# Altium schematic sheet 04 SOC_PORT3~5.SchDoc
size 513 x 386 mm
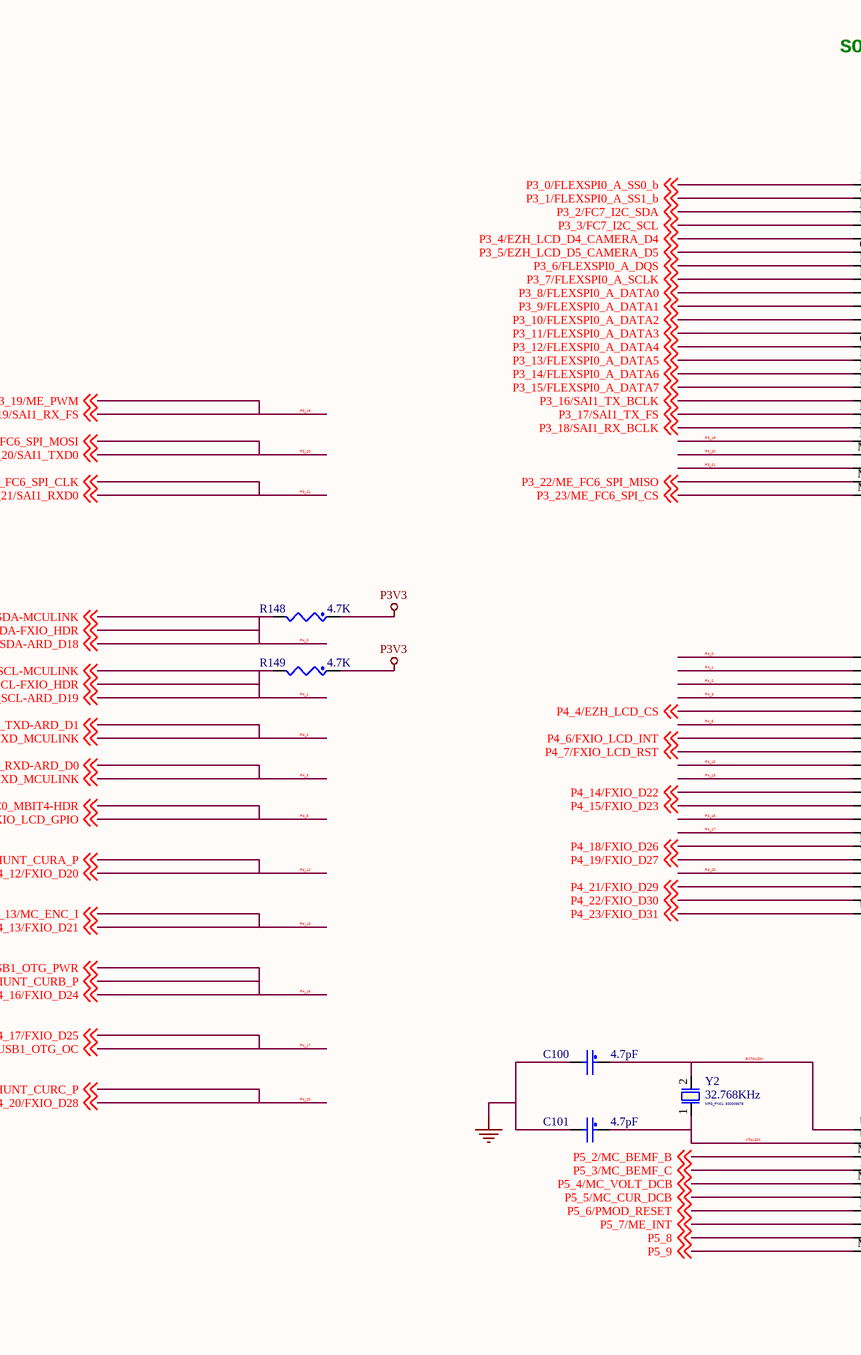
[diagram p0: 04 SOC_PORT3~5.SchDoc, left]
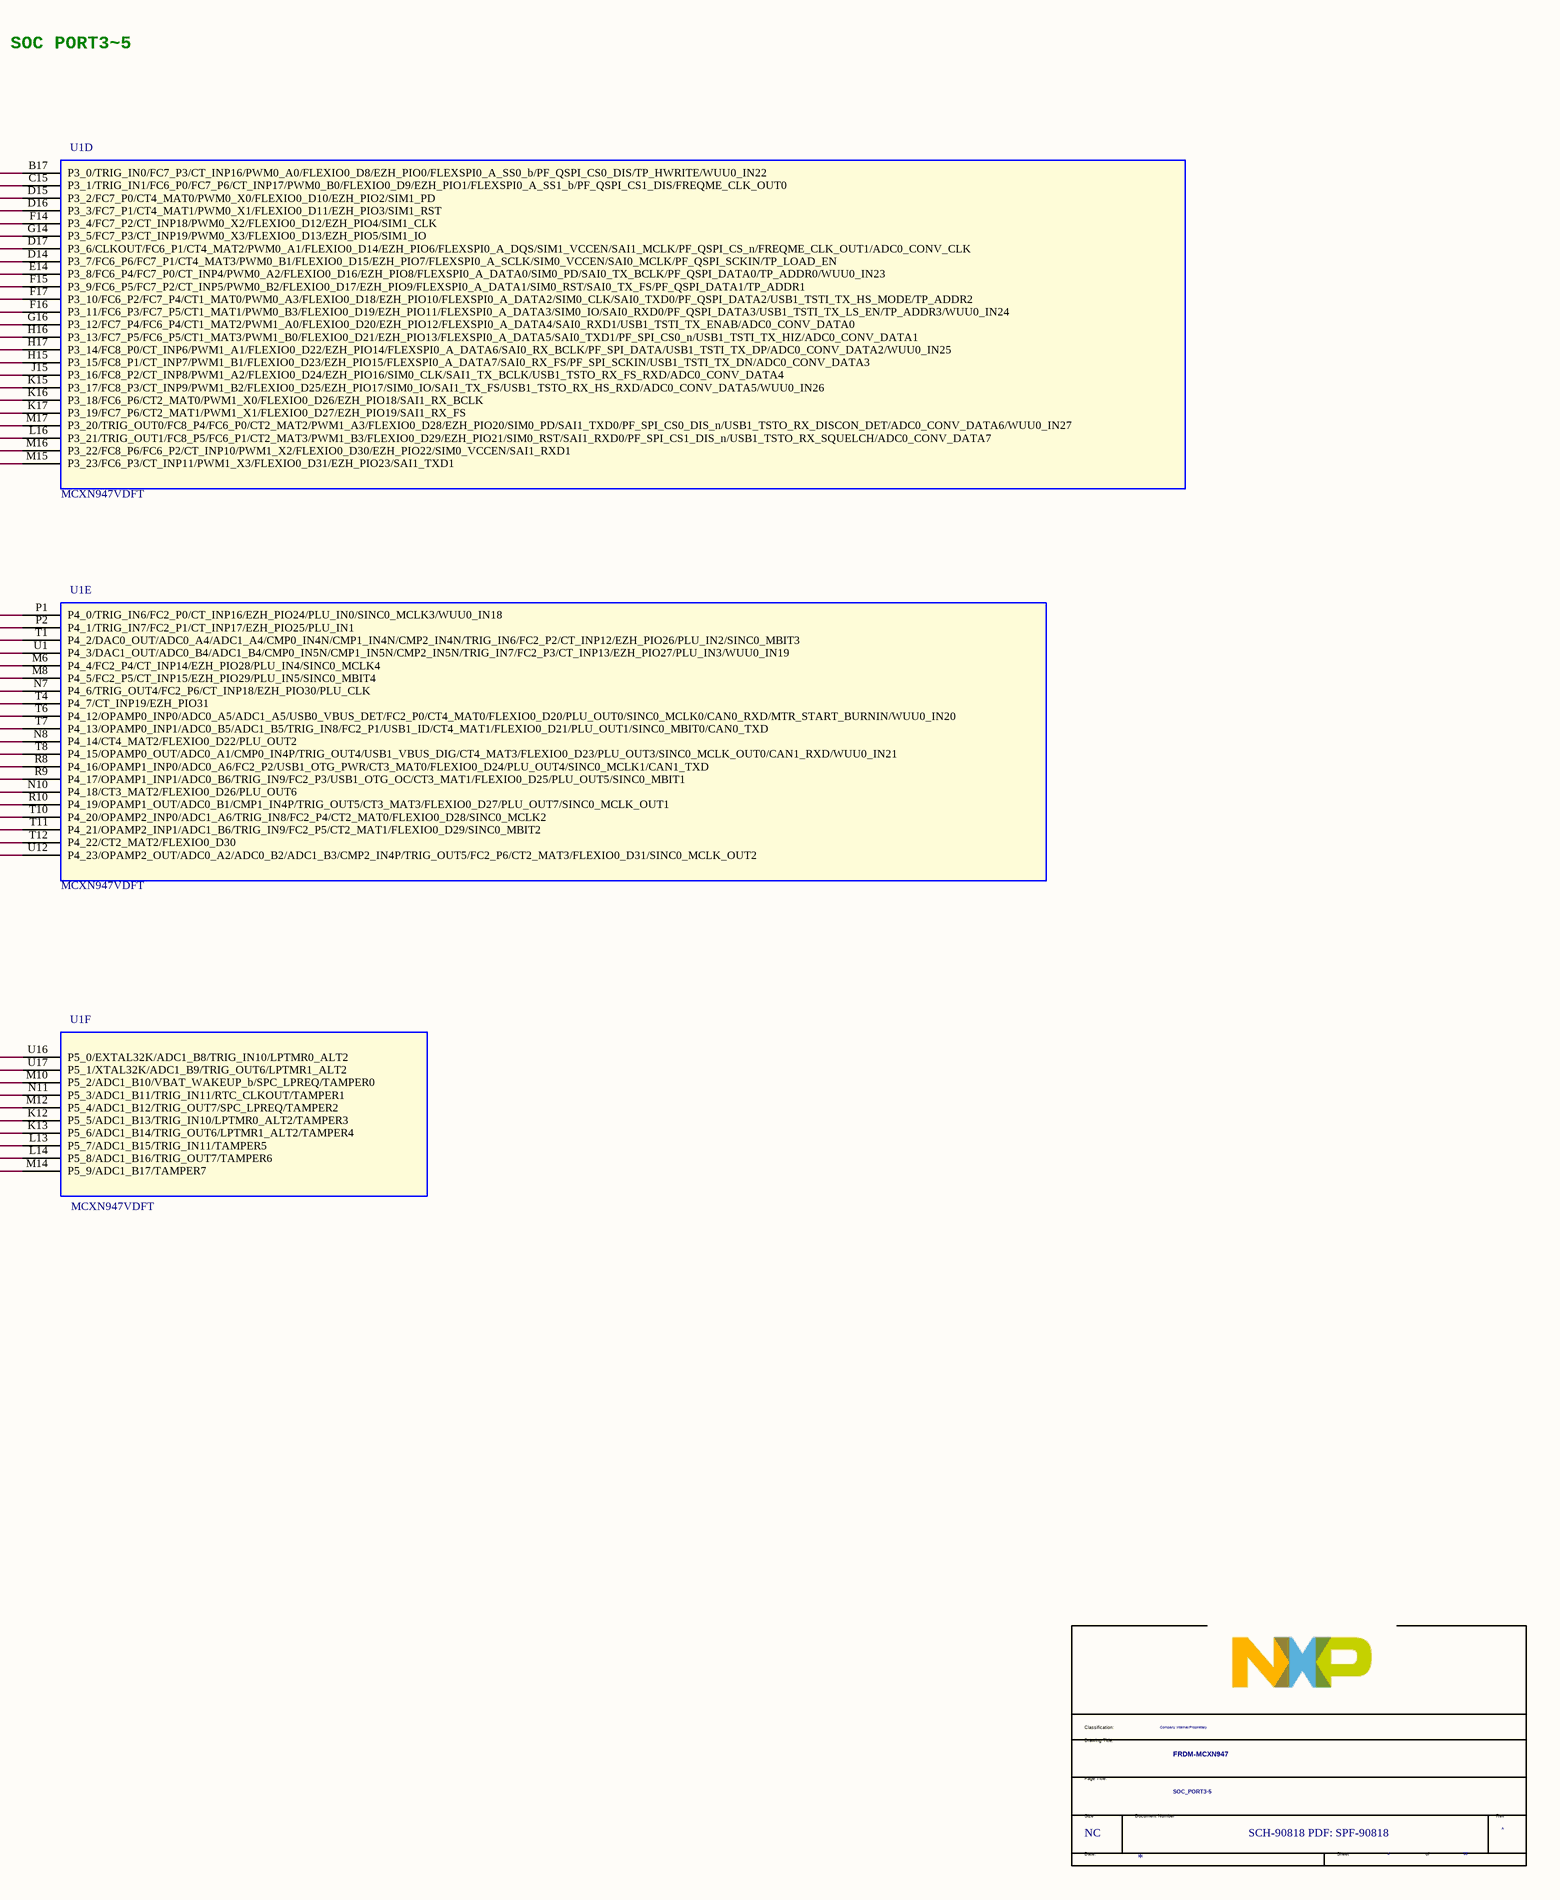
[diagram p1: 04 SOC_PORT3~5.SchDoc, right]

## Parts
*  Doc: SCH-90818 PDF: SPF-90818  RevCode: A  Title: FRDM-MCXN947  Page Size: NC  Page Number: 4  Page Count: 13  PageTitle: SOC_PORT3-5  Classification: Company Internal/Proprietary  (hidden comment: TitleBlock_FS)  (graphical)
C100  4.7pF  [CC0402_25]
C101  4.7pF  [CC0402_25]
R148  4.7K  [RC0402_25]
R149  4.7K  [RC0402_25]
U1  MCXN947VDFT  [bga184_0p5_9x9_sm]  (parts D,E,F of 8)
Y2  32.768KHz  MFG_PN01: 830009678  [XTAL2-3p2x1p5-SM]

## Nets
GND: C100.2 C101.2
P3V3: R148.1 R149.1
EXTAL32K: C100.1 U1.U16(P5_0/EXTAL32K/ADC1_B8/TRIG_IN10/LPTMR0_ALT2) Y2.2
P3_0/FLEXSPI0_A_SS0_b: U1.B17(P3_0/TRIG_IN0/FC7_P3/CT_INP16/PWM0_A0/FLEXIO0_D8/EZH_PIO0/FLEXSPI0_A_SS0_b/PF_QSPI_CS0_DIS/TP_HWRITE/WUU0_IN22) ; off-sheet P3_0/FLEXSPI0_A_SS0_b
P3_1/FLEXSPI0_A_SS1_b: U1.C15(P3_1/TRIG_IN1/FC6_P0/FC7_P6/CT_INP17/PWM0_B0/FLEXIO0_D9/EZH_PIO1/FLEXSPI0_A_SS1_b/PF_QSPI_CS1_DIS/FREQME_CLK_OUT0) ; off-sheet P3_1/FLEXSPI0_A_SS1_b
P3_2/FC7_I2C_SDA: U1.D15(P3_2/FC7_P0/CT4_MAT0/PWM0_X0/FLEXIO0_D10/EZH_PIO2/SIM1_PD) ; off-sheet P3_2/FC7_I2C_SDA
P3_3/FC7_I2C_SCL: U1.D16(P3_3/FC7_P1/CT4_MAT1/PWM0_X1/FLEXIO0_D11/EZH_PIO3/SIM1_RST) ; off-sheet P3_3/FC7_I2C_SCL
P3_4/EZH_LCD_D4_CAMERA_D4: U1.F14(P3_4/FC7_P2/CT_INP18/PWM0_X2/FLEXIO0_D12/EZH_PIO4/SIM1_CLK) ; off-sheet P3_4/EZH_LCD_D4_CAMERA_D4
P3_5/EZH_LCD_D5_CAMERA_D5: U1.G14(P3_5/FC7_P3/CT_INP19/PWM0_X3/FLEXIO0_D13/EZH_PIO5/SIM1_IO) ; off-sheet P3_5/EZH_LCD_D5_CAMERA_D5
P3_6/FLEXSPI0_A_DQS: U1.D17(P3_6/CLKOUT/FC6_P1/CT4_MAT2/PWM0_A1/FLEXIO0_D14/EZH_PIO6/FLEXSPI0_A_DQS/SIM1_VCCEN/SAI1_MCLK/PF_QSPI_CS_n/FREQME_CLK_OUT1/ADC0_CONV_CLK) ; off-sheet P3_6/FLEXSPI0_A_DQS
P3_7/FLEXSPI0_A_SCLK: U1.D14(P3_7/FC6_P6/FC7_P1/CT4_MAT3/PWM0_B1/FLEXIO0_D15/EZH_PIO7/FLEXSPI0_A_SCLK/SIM0_VCCEN/SAI0_MCLK/PF_QSPI_SCKIN/TP_LOAD_EN) ; off-sheet P3_7/FLEXSPI0_A_SCLK
P3_8/FLEXSPI0_A_DATA0: U1.E14(P3_8/FC6_P4/FC7_P0/CT_INP4/PWM0_A2/FLEXIO0_D16/EZH_PIO8/FLEXSPI0_A_DATA0/SIM0_PD/SAI0_TX_BCLK/PF_QSPI_DATA0/TP_ADDR0/WUU0_IN23) ; off-sheet P3_8/FLEXSPI0_A_DATA0
P3_9/FLEXSPI0_A_DATA1: U1.F15(P3_9/FC6_P5/FC7_P2/CT_INP5/PWM0_B2/FLEXIO0_D17/EZH_PIO9/FLEXSPI0_A_DATA1/SIM0_RST/SAI0_TX_FS/PF_QSPI_DATA1/TP_ADDR1) ; off-sheet P3_9/FLEXSPI0_A_DATA1
P3_10/FLEXSPI0_A_DATA2: U1.F17(P3_10/FC6_P2/FC7_P4/CT1_MAT0/PWM0_A3/FLEXIO0_D18/EZH_PIO10/FLEXSPI0_A_DATA2/SIM0_CLK/SAI0_TXD0/PF_QSPI_DATA2/USB1_TSTI_TX_HS_MODE/TP_ADDR2) ; off-sheet P3_10/FLEXSPI0_A_DATA2
P3_11/FLEXSPI0_A_DATA3: U1.F16(P3_11/FC6_P3/FC7_P5/CT1_MAT1/PWM0_B3/FLEXIO0_D19/EZH_PIO11/FLEXSPI0_A_DATA3/SIM0_IO/SAI0_RXD0/PF_QSPI_DATA3/USB1_TSTI_TX_LS_EN/TP_ADDR3/WUU0_IN24) ; off-sheet P3_11/FLEXSPI0_A_DATA3
P3_12/FLEXSPI0_A_DATA4: U1.G16(P3_12/FC7_P4/FC6_P4/CT1_MAT2/PWM1_A0/FLEXIO0_D20/EZH_PIO12/FLEXSPI0_A_DATA4/SAI0_RXD1/USB1_TSTI_TX_ENAB/ADC0_CONV_DATA0) ; off-sheet P3_12/FLEXSPI0_A_DATA4
P3_13/FLEXSPI0_A_DATA5: U1.H16(P3_13/FC7_P5/FC6_P5/CT1_MAT3/PWM1_B0/FLEXIO0_D21/EZH_PIO13/FLEXSPI0_A_DATA5/SAI0_TXD1/PF_SPI_CS0_n/USB1_TSTI_TX_HIZ/ADC0_CONV_DATA1) ; off-sheet P3_13/FLEXSPI0_A_DATA5
P3_14/FLEXSPI0_A_DATA6: U1.H17(P3_14/FC8_P0/CT_INP6/PWM1_A1/FLEXIO0_D22/EZH_PIO14/FLEXSPI0_A_DATA6/SAI0_RX_BCLK/PF_SPI_DATA/USB1_TSTI_TX_DP/ADC0_CONV_DATA2/WUU0_IN25) ; off-sheet P3_14/FLEXSPI0_A_DATA6
P3_15/FLEXSPI0_A_DATA7: U1.H15(P3_15/FC8_P1/CT_INP7/PWM1_B1/FLEXIO0_D23/EZH_PIO15/FLEXSPI0_A_DATA7/SAI0_RX_FS/PF_SPI_SCKIN/USB1_TSTI_TX_DN/ADC0_CONV_DATA3) ; off-sheet P3_15/FLEXSPI0_A_DATA7
P3_16/SAI1_TX_BCLK: U1.J15(P3_16/FC8_P2/CT_INP8/PWM1_A2/FLEXIO0_D24/EZH_PIO16/SIM0_CLK/SAI1_TX_BCLK/USB1_TSTO_RX_FS_RXD/ADC0_CONV_DATA4) ; off-sheet P3_16/SAI1_TX_BCLK
P3_17/SAI1_TX_FS: U1.K15(P3_17/FC8_P3/CT_INP9/PWM1_B2/FLEXIO0_D25/EZH_PIO17/SIM0_IO/SAI1_TX_FS/USB1_TSTO_RX_HS_RXD/ADC0_CONV_DATA5/WUU0_IN26) ; off-sheet P3_17/SAI1_TX_FS
P3_18/SAI1_RX_BCLK: U1.K16(P3_18/FC6_P6/CT2_MAT0/PWM1_X0/FLEXIO0_D26/EZH_PIO18/SAI1_RX_BCLK) ; off-sheet P3_18/SAI1_RX_BCLK
P3_19: U1.K17(P3_19/FC7_P6/CT2_MAT1/PWM1_X1/FLEXIO0_D27/EZH_PIO19/SAI1_RX_FS) ; off-sheet P3_19/ME_PWM, off-sheet P3_19/SAI1_RX_FS  [also labelled P3_19/ME_PWM, P3_19/SAI1_RX_FS]
P3_20: U1.M17(P3_20/TRIG_OUT0/FC8_P4/FC6_P0/CT2_MAT2/PWM1_A3/FLEXIO0_D28/EZH_PIO20/SIM0_PD/SAI1_TXD0/PF_SPI_CS0_DIS_n/USB1_TSTO_RX_DISCON_DET/ADC0_CONV_DATA6/WUU0_IN27) ; off-sheet P3_20/ME_FC6_SPI_MOSI, off-sheet P3_20/SAI1_TXD0  [also labelled P3_20/ME_FC6_SPI_MOSI, P3_20/SAI1_TXD0]
P3_21: U1.L16(P3_21/TRIG_OUT1/FC8_P5/FC6_P1/CT2_MAT3/PWM1_B3/FLEXIO0_D29/EZH_PIO21/SIM0_RST/SAI1_RXD0/PF_SPI_CS1_DIS_n/USB1_TSTO_RX_SQUELCH/ADC0_CONV_DATA7) ; off-sheet P3_21/ME_FC6_SPI_CLK, off-sheet P3_21/SAI1_RXD0  [also labelled P3_21/ME_FC6_SPI_CLK, P3_21/SAI1_RXD0]
P3_22/ME_FC6_SPI_MISO: U1.M16(P3_22/FC8_P6/FC6_P2/CT_INP10/PWM1_X2/FLEXIO0_D30/EZH_PIO22/SIM0_VCCEN/SAI1_RXD1) ; off-sheet P3_22/ME_FC6_SPI_MISO
P3_23/ME_FC6_SPI_CS: U1.M15(P3_23/FC6_P3/CT_INP11/PWM1_X3/FLEXIO0_D31/EZH_PIO23/SAI1_TXD1) ; off-sheet P3_23/ME_FC6_SPI_CS
P4_0: R148.2 U1.P1(P4_0/TRIG_IN6/FC2_P0/CT_INP16/EZH_PIO24/PLU_IN0/SINC0_MCLK3/WUU0_IN18) ; off-sheet P4_0/FC2_I2C_SDA-FXIO_HDR, off-sheet P4_0/FC2_I2C_SDA-ARD_D18, off-sheet P4_0/FC2_I2C_SDA-MCULINK  [also labelled P4_0/FC2_I2C_SDA-ARD_D18, P4_0/FC2_I2C_SDA-FXIO_HDR, P4_0/FC2_I2C_SDA-MCULINK]
P4_1: R149.2 U1.P2(P4_1/TRIG_IN7/FC2_P1/CT_INP17/EZH_PIO25/PLU_IN1) ; off-sheet P4_1/FC2_I2C_SCL-FXIO_HDR, off-sheet P4_1/FC2_I2C_SCL-ARD_D19, off-sheet P4_1/FC2_I2C_SCL-MCULINK  [also labelled P4_1/FC2_I2C_SCL-ARD_D19, P4_1/FC2_I2C_SCL-FXIO_HDR, P4_1/FC2_I2C_SCL-MCULINK]
P4_2: U1.T1(P4_2/DAC0_OUT/ADC0_A4/ADC1_A4/CMP0_IN4N/CMP1_IN4N/CMP2_IN4N/TRIG_IN6/FC2_P2/CT_INP12/EZH_PIO26/PLU_IN2/SINC0_MBIT3) ; off-sheet P4_2/FC2_P2_UART_TXD_MCULINK, off-sheet P4_2/FC2_UART_TXD-ARD_D1  [also labelled P4_2/FC2_P2_UART_TXD_MCULINK, P4_2/FC2_UART_TXD-ARD_D1]
P4_3: U1.U1(P4_3/DAC1_OUT/ADC0_B4/ADC1_B4/CMP0_IN5N/CMP1_IN5N/CMP2_IN5N/TRIG_IN7/FC2_P3/CT_INP13/EZH_PIO27/PLU_IN3/WUU0_IN19) ; off-sheet P4_3/FC2_P3_UART_TXD_MCULINK, off-sheet P4_3/FC2_UART_RXD-ARD_D0  [also labelled P4_3/FC2_P3_UART_TXD_MCULINK, P4_3/FC2_UART_RXD-ARD_D0]
P4_4/EZH_LCD_CS: U1.M6(P4_4/FC2_P4/CT_INP14/EZH_PIO28/PLU_IN4/SINC0_MCLK4) ; off-sheet P4_4/EZH_LCD_CS
P4_5: U1.M8(P4_5/FC2_P5/CT_INP15/EZH_PIO29/PLU_IN5/SINC0_MBIT4) ; off-sheet P4_5/SINC0_MBIT4-HDR, off-sheet P4_5/FXIO_LCD_GPIO  [also labelled P4_5/FXIO_LCD_GPIO, P4_5/SINC0_MBIT4-HDR]
P4_6/FXIO_LCD_INT: U1.N7(P4_6/TRIG_OUT4/FC2_P6/CT_INP18/EZH_PIO30/PLU_CLK) ; off-sheet P4_6/FXIO_LCD_INT
P4_7/FXIO_LCD_RST: U1.T4(P4_7/CT_INP19/EZH_PIO31) ; off-sheet P4_7/FXIO_LCD_RST
P4_12: U1.T6(P4_12/OPAMP0_INP0/ADC0_A5/ADC1_A5/USB0_VBUS_DET/FC2_P0/CT4_MAT0/FLEXIO0_D20/PLU_OUT0/SINC0_MCLK0/CAN0_RXD/MTR_START_BURNIN/WUU0_IN20) ; off-sheet P4_12/RSHUNT_CURA_P, off-sheet P4_12/FXIO_D20  [also labelled P4_12/FXIO_D20, P4_12/RSHUNT_CURA_P]
P4_13: U1.T7(P4_13/OPAMP0_INP1/ADC0_B5/ADC1_B5/TRIG_IN8/FC2_P1/USB1_ID/CT4_MAT1/FLEXIO0_D21/PLU_OUT1/SINC0_MBIT0/CAN0_TXD) ; off-sheet P4_13/MC_ENC_I, off-sheet P4_13/FXIO_D21  [also labelled P4_13/FXIO_D21, P4_13/MC_ENC_I]
P4_14/FXIO_D22: U1.N8(P4_14/CT4_MAT2/FLEXIO0_D22/PLU_OUT2) ; off-sheet P4_14/FXIO_D22
P4_15/FXIO_D23: U1.T8(P4_15/OPAMP0_OUT/ADC0_A1/CMP0_IN4P/TRIG_OUT4/USB1_VBUS_DIG/CT4_MAT3/FLEXIO0_D23/PLU_OUT3/SINC0_MCLK_OUT0/CAN1_RXD/WUU0_IN21) ; off-sheet P4_15/FXIO_D23
P4_16: U1.R8(P4_16/OPAMP1_INP0/ADC0_A6/FC2_P2/USB1_OTG_PWR/CT3_MAT0/FLEXIO0_D24/PLU_OUT4/SINC0_MCLK1/CAN1_TXD) ; off-sheet P4_16/RSHUNT_CURB_P, off-sheet P4_16/FXIO_D24, off-sheet P4_16/USB1_OTG_PWR  [also labelled P4_16/FXIO_D24, P4_16/RSHUNT_CURB_P, P4_16/USB1_OTG_PWR]
P4_17: U1.R9(P4_17/OPAMP1_INP1/ADC0_B6/TRIG_IN9/FC2_P3/USB1_OTG_OC/CT3_MAT1/FLEXIO0_D25/PLU_OUT5/SINC0_MBIT1) ; off-sheet P4_17/FXIO_D25, off-sheet P4_17/USB1_OTG_OC  [also labelled P4_17/FXIO_D25, P4_17/USB1_OTG_OC]
P4_18/FXIO_D26: U1.N10(P4_18/CT3_MAT2/FLEXIO0_D26/PLU_OUT6) ; off-sheet P4_18/FXIO_D26
P4_19/FXIO_D27: U1.R10(P4_19/OPAMP1_OUT/ADC0_B1/CMP1_IN4P/TRIG_OUT5/CT3_MAT3/FLEXIO0_D27/PLU_OUT7/SINC0_MCLK_OUT1) ; off-sheet P4_19/FXIO_D27
P4_20: U1.T10(P4_20/OPAMP2_INP0/ADC1_A6/TRIG_IN8/FC2_P4/CT2_MAT0/FLEXIO0_D28/SINC0_MCLK2) ; off-sheet P4_20/RSHUNT_CURC_P, off-sheet P4_20/FXIO_D28  [also labelled P4_20/FXIO_D28, P4_20/RSHUNT_CURC_P]
P4_21/FXIO_D29: U1.T11(P4_21/OPAMP2_INP1/ADC1_B6/TRIG_IN9/FC2_P5/CT2_MAT1/FLEXIO0_D29/SINC0_MBIT2) ; off-sheet P4_21/FXIO_D29
P4_22/FXIO_D30: U1.T12(P4_22/CT2_MAT2/FLEXIO0_D30) ; off-sheet P4_22/FXIO_D30
P4_23/FXIO_D31: U1.U12(P4_23/OPAMP2_OUT/ADC0_A2/ADC0_B2/ADC1_B3/CMP2_IN4P/TRIG_OUT5/FC2_P6/CT2_MAT3/FLEXIO0_D31/SINC0_MCLK_OUT2) ; off-sheet P4_23/FXIO_D31
P5_2/MC_BEMF_B: U1.M10(P5_2/ADC1_B10/VBAT_WAKEUP_b/SPC_LPREQ/TAMPER0) ; off-sheet P5_2/MC_BEMF_B
P5_3/MC_BEMF_C: U1.N11(P5_3/ADC1_B11/TRIG_IN11/RTC_CLKOUT/TAMPER1) ; off-sheet P5_3/MC_BEMF_C
P5_4/MC_VOLT_DCB: U1.M12(P5_4/ADC1_B12/TRIG_OUT7/SPC_LPREQ/TAMPER2) ; off-sheet P5_4/MC_VOLT_DCB
P5_5/MC_CUR_DCB: U1.K12(P5_5/ADC1_B13/TRIG_IN10/LPTMR0_ALT2/TAMPER3) ; off-sheet P5_5/MC_CUR_DCB
P5_6/PMOD_RESET: U1.K13(P5_6/ADC1_B14/TRIG_OUT6/LPTMR1_ALT2/TAMPER4) ; off-sheet P5_6/PMOD_RESET
P5_7/ME_INT: U1.L13(P5_7/ADC1_B15/TRIG_IN11/TAMPER5) ; off-sheet P5_7/ME_INT
P5_8: U1.L14(P5_8/ADC1_B16/TRIG_OUT7/TAMPER6) ; off-sheet P5_8
P5_9: U1.M14(P5_9/ADC1_B17/TAMPER7) ; off-sheet P5_9
XTAL32K: C101.1 U1.U17(P5_1/XTAL32K/ADC1_B9/TRIG_OUT6/LPTMR1_ALT2) Y2.1

## Notes on the sheet
- SOC PORT3~5
- (in symbol TitleBlock_FS) Classification:; Drawing Title:; Page Title:; Size; Document Number; Rev; Date:; Sheet; of

## Library data of the parts
* = TitleBlock_FS: Classification: Public, Company Internal/Proprietary, Company Confidential,  Company Secret; Variant Name: <Core Design>; OrgAddr2: Austin, TX 78735-8598; OrgAddr1: 6501 William Cannon Drive West; OrgName: NXP Semiconductors; Page Create Date: March  8, 1995; Page Modify Date: *
C100 C101 = CAP_NP: CAP CER 4.7PF 50V 0.5pF C0G 0402; CLASS: DISCRETE; MFG_PN01: 885012005053; MFG_NAME01: Wurth Elektronik; Temp Range: -55C to +125C; CAD_APPROVED: yes; FPLIST: CC0402_25,CC0402_HD,0402_CC,capc0402_l; AGILE_PN: 150-80750; PCB Footprint: CC0402_25; ROHS: yes; Rated Voltage: 50V; Tolerance: 0.5pF; Package Type: SMD/SMT; HEIGHT: 0.5 mm; Package Size: 0402 (1005 metric)
R148 = RES: RES MF 4.7K 1/16W 5% 0402; CLASS: DISCRETE; Pkg: 0402; AGILE_PN: 470-75626; FPLIST: RC0402_25,RC0402_HD,0402_CC,RC0402_X2; CAD_APPROVED: Yes; MFG_NAME01: BOURNS; MFG_PN01: CR0402-JW-472GLF; PCB Footprint: RC0402_25; HEIGHT: 0.41mm; Tolerance: 5%; ROHS: Yes
R149 = RES: RES MF 4.7K 1/16W 5% 0402; CLASS: DISCRETE; MFG_PN01: CR0402-JW-472GLF; MFG_NAME01: BOURNS; CAD_APPROVED: Yes; FPLIST: RC0402_25,RC0402_HD,0402_CC,RC0402_X2; AGILE_PN: 470-75626; Pkg: 0402; PCB Footprint: RC0402_25; ROHS: Yes; Tolerance: 5%; HEIGHT: 0.41mm
U1 = MCXN947VDFT_BGA_184P: IC MCU LOW POWER 150MHz ARM Nirvana -- VFBGA184; SPLIT_INST: TRUE; AGILE_PN: TMP-CIP-10342; CAD_APPROVED: Yes; PRE_APN: 344-02549; Temp Range: -40  ¡ãC to +105 ¡ãC; MFG_NAME01: NXP SEMICONDUCTOR; CLASS: IC; Package Size: 9x9; HEIGHT: 0.98 MM; ROHS: Yes; MFG_PN01: MCXN947VDFT; 3D_Mechanical_Footprint_File: http://fcl.am.freescale.net/ALLEGRO/step/bga184_0p5_9x9_sm.STEP; PCB Footprint: bga184_0p5_9x9_sm
Y2 = CRYSTAL: XTAL 32.768kHz 12.5pF 1.05pF 20ppm SMT; CLASS: IC; MFG_NAME01: Wurth Electronics Inc.; CAD_APPROVED: Yes; AGILE_PN: 230-78676; 3D_Mechanical_Footprint_File: http://fcl.am.freescale.net/ALLEGRO/step/xtal2-3p2x1p5-sm.step; ROHS: Yes; HEIGHT: 0.9 MM; PCB Footprint: XTAL2-3p2x1p5-SM